# Altium project InputFilter.PrjPcb
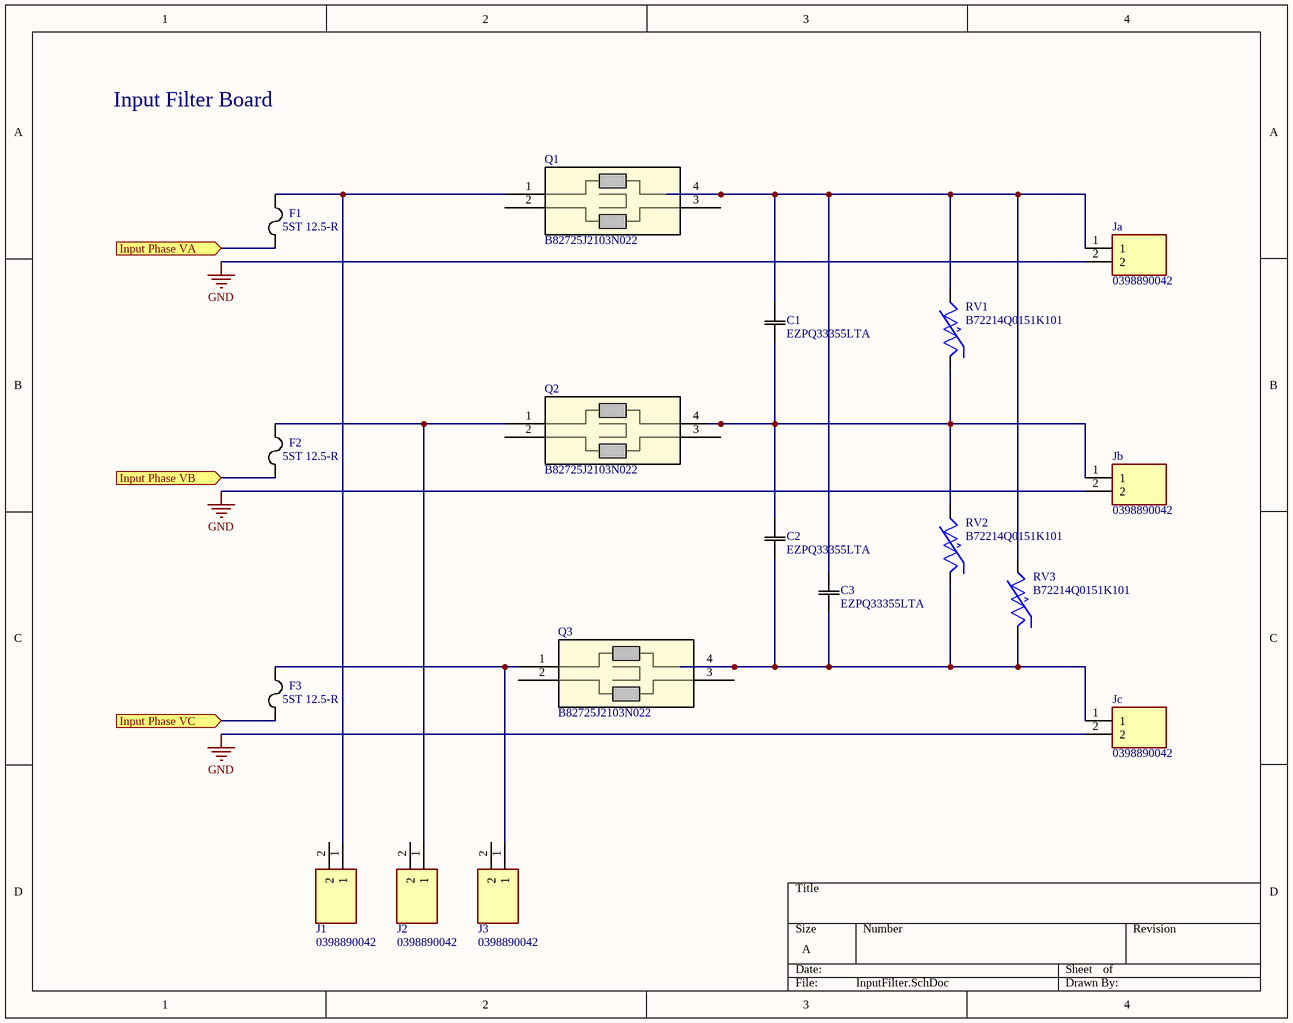
[diagram p0: InputFilter.SchDoc]
1 sheet, 18 parts. Net scope: flat (ports and power ports of the same name join across sheets).
Board file: InputFilter.PcbDoc

## Sheet InputFilter.SchDoc
size A; SheetNumber: 1; SheetTotal: 1

### Parts
C1  EZPQ33355LTA  [CAP_EZPQ33_41p5X17-37p5_PAN]
C2  EZPQ33355LTA  [CAP_EZPQ33_41p5X17-37p5_PAN]
C3  EZPQ33355LTA  [CAP_EZPQ33_41p5X17-37p5_PAN]
F1  5ST 12.5-R  [5S_MELF_BEL]
F2  5ST 12.5-R  [5S_MELF_BEL]
F3  5ST 12.5-R  [5S_MELF_BEL]
J1  0398890042  [0398890042]
J2  0398890042  [0398890042]
J3  0398890042  [0398890042]
Ja  0398890042  [0398890042]
Jb  0398890042  [0398890042]
Jc  0398890042  [0398890042]
Q1  B82725J2103N022  [B82725J2103N022_TDK]
Q2  B82725J2103N022  [B82725J2103N022_TDK]
Q3  B82725J2103N022  [B82725J2103N022_TDK]
RV1  B72214Q0151K101  [VAR_B72214Q0151K101]
RV2  B72214Q0151K101  [VAR_B72214Q0151K101]
RV3  B72214Q0151K101  [VAR_B72214Q0151K101]

### Ports
Input Phase VA (in), Input Phase VB (in), Input Phase VC (in)

### Nets
GND: Ja.2 Jb.2 Jc.2
NetC1_1: C1.1 C2.2 Jb.1 Q2.4 RV1.1 RV2.2
NetC1_2: C1.2 C3.2 Ja.1 Q1.4 RV1.2 RV3.2
NetC2_1: C2.1 C3.1 Jc.1 Q3.4 RV2.1 RV3.1
NetF1_1: F1.1 ; port Input Phase VA
NetF1_2: F1.2 J1.1 Q1.1
NetF2_1: F2.1 ; port Input Phase VB
NetF2_2: F2.2 J2.1 Q2.1
NetF3_1: F3.1 ; port Input Phase VC
NetF3_2: F3.2 J3.1 Q3.1

Not connected (* = marked no-connect by the designer): J1 2; J2 2; J3 2; Q1 2 3; Q2 2 3; Q3 2 3

### Notes on the sheet
- Input Filter Board

### Library data of the parts
C1-C3 = EZPQ33355LTA: No Description Available; Mfr_Name: Panasonic; Type: Film Capacitor
F1-F3 = 5ST 12.5-R: No Description Available; Mfr_Name: Belfuse
J1-J3 Ja Jb Jc = 0398890042: Conn Eurostyle Block 2 POS 5.08mm Solder ST Thru-Hole 17.5A/Contact; Manufacturer_Name: Molex; Geometry.Height: 10.25mm; TTI Part Number: *; TTI Price/Stock: *; Manufacturer_Part_Number: 0398890042; Datasheet Link: https://tools.molex.com/pdm_docs/sd/398890042_sd.pdf
Q1-Q3 = B82725J2103N022: No Description Available; Mfr_Name: TDK; RefDes: RefDes; Type: Type
RV1-RV3 = B72214Q0151K101: 240 V 8 kA Varistor 1 Circuit Through Hole Radial; MF: EPCOS; SnapEDA_Link: https://www.snapeda.com/parts/B72214Q0151K101/EPCOS/view-part/?ref=snap; Package: None; Value: *; MP: B72214Q0151K101; Check_prices: https://www.snapeda.com/parts/B72214Q0151K101/EPCOS/view-part/?ref=eda